# EasyEDA Pro project GEEKS_DEVELOPMENT_BOARD_STM32F4.eprj, board PCB2
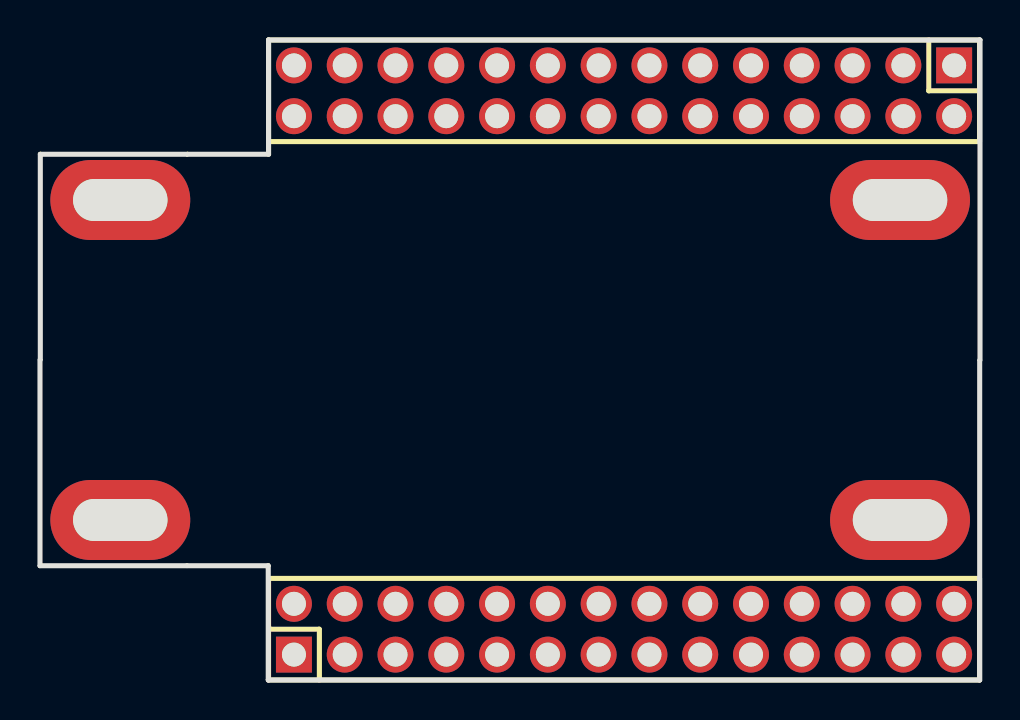
[diagram p4: board, top side]
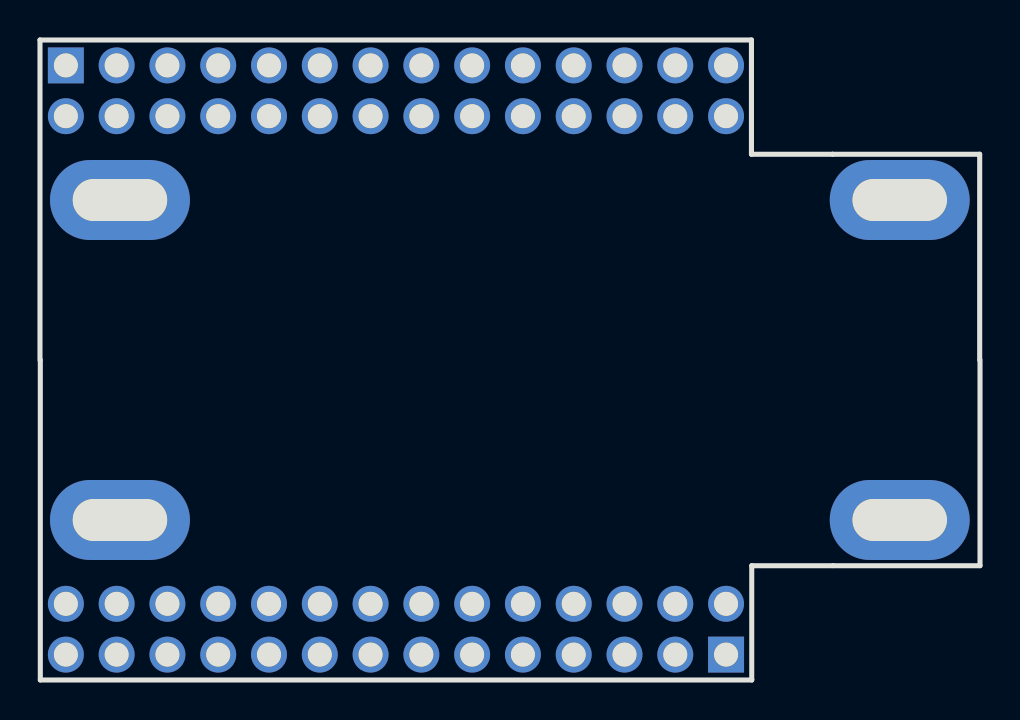
[diagram p5: board, bottom side, seen from below]

Outline 47.02 x 32 mm; copper layers: Top Layer, Inner1, Inner2, Bottom Layer. Coordinates in mm from the lower left corner of the outline.
Outline path: 0,16 0,5.71 11.42,5.71 11.42,0 47,0 47,16 ; 0.02,16 0.02,26.29 11.43,26.29 11.43,32 47.02,32 47.02,16
Stack: Top Layer 0.035mm 外层铜厚1oz / Dielectric1 0.2104mm 7628 RC49% 8.6mil / Inner1 0.0152mm 内层铜厚 / Dielectric2 1.065mm 1.1mm H/HOZ 含铜 / Inner2 0.0152mm 内层铜厚 / Dielectric3 0.2104mm 7628 RC49% 8.6mil / Bottom Layer 0.035mm 外层铜厚1oz

## Design rules (mm)
net FS_D-: DP1
net FS_D+: DP1
template: 自定义配置
spacing copperThickness1oz (default): track to track 0.102, other pairs 0.152 to 0.3
spacing copperThickness2oz: track to track 0.203, other pairs 0.152 to 0.3
track width copperThickness1oz (default): min 0.13, default 0.13, max 0.5
track width copperThickness2oz: min 0.203, default 0.254, max 2.54
track width power: min 0.3, default 0.3, max 0.3
track width 12v: min 0.5, default 0.5, max 0.5
differential pair differentialPair (default): width min 0.127, default 0.254, max 2.54; gap min 0.152, default 0.152
via viaSize (default): diameter min 0.5, default 0.61, max 10; hole min 0.3, default 0.305, max 6.3
net 3V3 uses power
net GND uses power
net 5V uses power

## Placement (name value [footprint] x y rotation side)
NOREF  -  [Pad_e89]  43.02 8 0 top
NOREF#2  -  [Pad_e85]  4.02 24 0 top
NOREF#3  -  [Pad_e87]  4.02 8 0 top
NOREF#4  -  [Pad_e88]  43.02 24 0 top
U32  GPHA201-1402A001A1BA  [HDR-TH_28P-P2.54-V-M-R2-C14-S2.54]  29.21 2.54 0 top
U33  GPHA201-1402A001A1BA  [HDR-TH_28P-P2.54-V-M-R2-C14-S2.54]  29.21 29.46 180 top

## Footprints (pads in the part's own frame, mm; a bottom-side part is the same pattern mirrored in y, then rotated)
HDR-TH_28P-P2.54-V-M-R2-C14-S2.54
  rect 1.8x1.8 hole 1.2: 1(-16.51,-1.27)
  round 1.8 hole 1.2: 2(-16.51,1.27) 3(-13.97,-1.27) 4(-13.97,1.27) 5(-11.43,-1.27) 6(-11.43,1.27) 7(-8.89,-1.27) 8(-8.89,1.27) 9(-6.35,-1.27) 10(-6.35,1.27) 11(-3.81,-1.27) 12(-3.81,1.27) 13(-1.27,-1.27) 14(-1.27,1.27) 15(1.27,-1.27) 16(1.27,1.27) 17(3.81,-1.27) 18(3.81,1.27) 19(6.35,-1.27) 20(6.35,1.27) 21(8.89,-1.27) 22(8.89,1.27) 23(11.43,-1.27) 24(11.43,1.27) 25(13.97,-1.27) 26(13.97,1.27) 27(16.51,-1.27) 28(16.51,1.27)
Pad_e85
  oval 7x4 hole 4.725x2.1: 1(0,0)
Pad_e87
  oval 7x4 hole 4.725x2.1: 1(0,0)
Pad_e88
  oval 7x4 hole 4.725x2.1: 1(0,0)
Pad_e89
  oval 7x4 hole 4.725x2.1: 1(0,0)

## Nets
As in the schematic, except:
3V3: U32.1 U32.2 U32.3 U32.4
5V: U33.25 U33.26 U33.27 U33.28
GND: U32.24 U32.25 U32.26 U32.27 U32.28 U33.1 U33.2 U33.3 U33.4

Pads without a net: NOREF 1; NOREF#2 1; NOREF#3 1; NOREF#4 1
